# EAGLE design 555 Astable 2 (EAGLE 6.5.0)
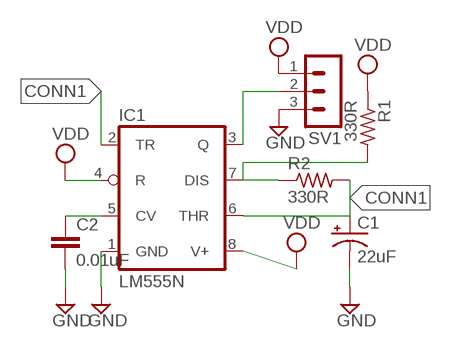
[diagram p0: schematic, sheet 1]

## Parts
C1  22uF  CPOL-USE1.8-4  [E1,8-4]
C2  0.01uF  C-EU050-024X044  [C050-024X044]
IC1  LM555N  [DIL08]
R1  330R  R-US_0207/10  [0207/10]
R2  330R  R-US_0207/10  [0207/10]
SV1  MA03-1  [MA03-1]

## Nets
CONN1: C1.+ IC1.2(TR) IC1.6(THR) R2.2
GND: C1.- C2.2 IC1.1(GND) SV1.3
N$1: C2.1 IC1.5(CV)
N$2: IC1.7(DIS) R1.2 R2.1
N$4: IC1.3(Q) SV1.2
VDD: IC1.4(R) IC1.8(V+) R1.1 SV1.1

## Library data of the parts
C1 = resistor:CPOL-US: POLARIZED CAPACITOR, American symbol
C2 = resistor:C-EU: CAPACITOR, European symbol
IC1 = linear:*555: TIMER
R1 R2 = resistor:R-US_: RESISTOR, American symbol
SV1 = con-lstb:MA03-1: PIN HEADER; OC_FARNELL: unknown; OC_NEWARK: unknown

## Board
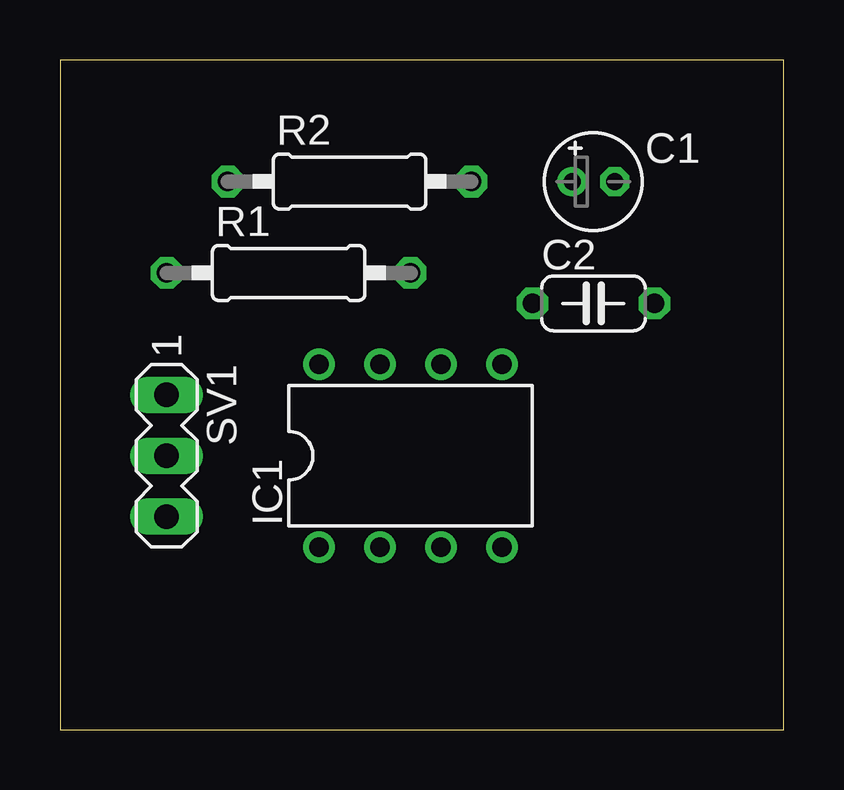
[diagram p1: board, top side]
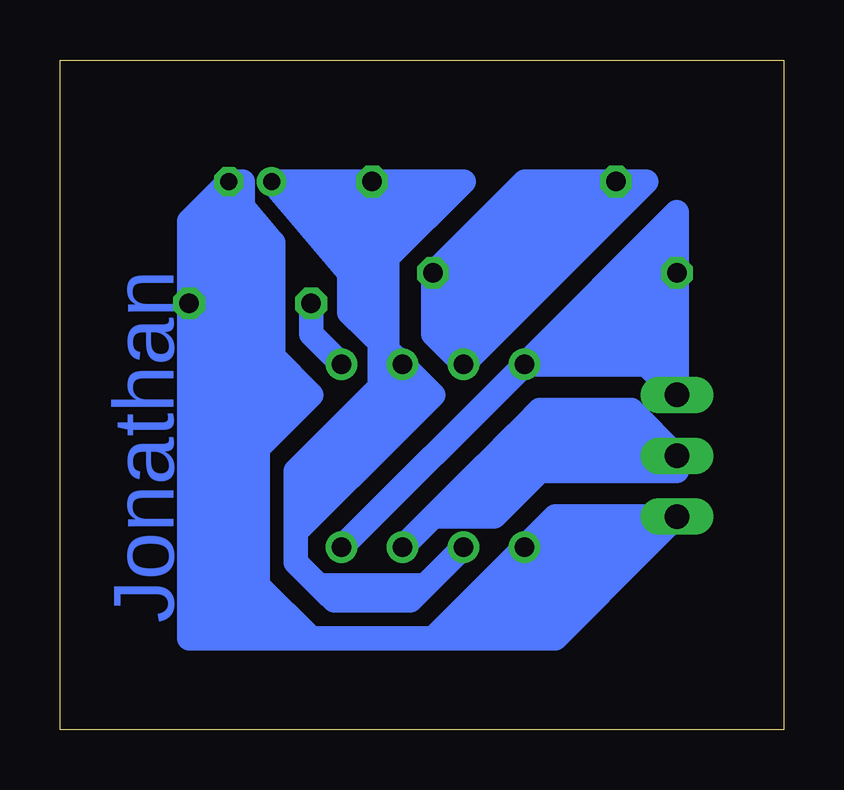
[diagram p2: board, bottom side, seen from below]

Size 30.15 x 27.93 mm. Coordinates in mm from the lower left corner, seen from the top.
Outline: 0,0 30.15,0 30.15,27.93 0,27.93 0,0
Copper layers (1*16): Top 0.035mm / dielectric 1.5mm / Bottom 0.035mm
Design rules "default": minimum track width 10mil, minimum drill 24mil, track to track 8mil, track to pad 8mil, pad to pad 8mil, via to via 8mil, smd to smd 8mil, copper to edge 40mil, drill to drill 8mil, minimum pad ring 10mil, minimum via ring 8mil, stop-mask expansion 4mil, vias tented up to drill 0mil, thermal gap 10mil

### Footprints (pad centres in the part's own frame; a part is rotated, then mirrored left to right if it is on the bottom)
E1,8-4 = drill 0.711 pad 1.168: + -0.889,0 | drill 0.711 pad 1.168 octagon: - 0.889,0
C050-024X044 = drill 0.813 octagon: 1 -2.54,0; 2 2.54,0
DIL08 = drill 0.813 pad 1.27: 1 -3.81,-3.81; 2 -1.27,-3.81; 3 1.27,-3.81; 4 3.81,-3.81; 5 3.81,3.81; 6 1.27,3.81; 7 -1.27,3.81; 8 -3.81,3.81
0207/10 = drill 0.813 octagon: 1 -5.08,0; 2 5.08,0
MA03-1 = drill 1.016 long: 1 -2.54,0; 2 0,0; 3 2.54,0

### Placement (x,y rotation side)
C1  22.23,22.86 0 top
C2  22.23,17.78 0 top
IC1  14.61,11.43 0 top
R1  9.53,19.05 0 top
R2  12.06,22.86 0 top
SV1  4.45,11.43 270 top

### Tracks (layer width: path | path; a pad name or v marks a point on that pad's centre or on a via)
CONN1
  Bottom 1.016: IC1.6 18.1,17.4 18.1,19.05 C1.+ R2.2 16.83,22.86 | IC1.6 15.88,13.97 | 15.88,13.97 15.88,12.7 | 19.37,6.03 19.05,5.71 | 15.88,12.7 14.61,13.97 IC1.6 | IC1.6 15.24,13.97 | 14.92,6.03 19.37,6.03 | 19.05,5.71 18.73,5.4 15.56,5.4 15.24,5.71 | IC1.2 15.24,5.71 | 15.24,5.71 19.05,5.71 | 19.37,6.03 20.32,6.99 20.32,8.26 | 20.32,8.26 15.88,12.7 | 16.83,14.29 20.32,10.79 20.32,9.53 | 20.32,8.26 20.32,9.53 | 20.32,9.53 15.88,13.97 | 14.29,22.86 13.34,22.86 16.51,19.68 16.51,13.97 17.14,13.34 | IC1.6 16.83,14.29 | 16.83,14.29 16.83,22.86 | 16.83,22.86 14.29,22.86 | 14.29,22.86 17.78,19.37 | 17.78,19.37 17.78,17.46 | 17.78,19.37 17.78,20 | 17.78,20 17.78,22.54 20.32,22.54 17.78,20 | 17.78,20 18.73,22.23 15.56,22.23 16.51,21.59
GND
  Bottom 1.016: C1.- 24.77,21.21 C2.2 | 5.71,7.62 IC1.1 | 5.71,7.62 SV1.3 5.08,8.89 | 5.71,7.62 9.53,3.81 10.16,3.81 | 11.43,3.81 12.7,3.81 | 14.61,3.81 19.68,3.81 | 19.68,3.81 21.91,6.03 | 21.91,6.03 22.86,6.99 | 24.13,8.26 24.77,8.89 24.77,9.53 | 5.08,8.89 6.35,8.89 | 7.62,8.89 8.26,8.89 | 8.26,8.89 9.53,8.89 14.61,3.81 | 14.61,3.81 13.34,3.81 | 13.34,3.81 12.7,3.81 | 12.7,3.81 7.62,8.89 | 6.35,8.89 11.43,3.81 | 11.43,3.81 10.16,3.81 | 10.16,3.81 5.08,8.89 | 6.35,8.89 7.62,8.89 | 8.26,8.89 13.34,3.81 | C2.2 24.13,17.78 | 23.5,17.78 22.86,17.78 | 22.86,17.78 22.86,22.23 | 22.86,22.23 22.86,22.86 24.13,21.59 24.13,18.41 23.5,18.41 23.5,21.59 22.86,17.78 | 22.86,17.78 22.86,6.99 | 22.86,6.99 23.18,7.3 | 23.18,7.3 23.5,7.62 | 24.13,8.26 24.13,17.78 | 24.13,17.78 23.5,17.78 | 23.5,17.78 23.5,7.62 | C2.2 22.54,17.78 22.54,22.54 | 22.54,22.54 23.18,22.86 22.54,22.86 22.54,22.54 | C2.2 21.91,17.78 | 21.27,20.32 22.86,22.23 | 22.86,22.23 21.91,20.95 21.91,17.78 | 21.91,6.03 21.91,17.78 | 21.91,17.78 21.27,17.78 | 21.27,17.78 21.27,15.56 | 21.27,13.65 21.27,12.38 | 21.27,12.38 22.23,11.43 | 24.77,9.53 21.27,12.38 | 21.27,12.38 19.68,13.97 21.27,15.56 | 21.27,15.56 21.27,13.65 | 21.27,13.65 20.64,13.97 21.27,15.56 | 21.27,17.78 21.27,20.32 | 21.27,20.32 21.59,19.05 | C2.2 24.77,9.53 | C2.2 24.77,3.81 24.13,3.81 | 19.68,3.81 24.13,3.81 | 24.13,3.81 24.13,8.26 | 24.13,8.26 23.5,7.62 | 23.18,7.3 23.18,4.13 22.23,4.13 22.23,6.03 21.27,4.13
N$1
  Bottom 1.016: C2.1 19.68,16.51 IC1.5
N$2
  Bottom 1.016: 12.7,15.88 IC1.7 14.61,16.51 R1.2 | 12.7,15.88 6.99,21.59 | 6.99,21.59 R2.1 | R1.2 14.61,17.78 13.97,17.14 | 13.34,16.51 12.7,15.88 | 6.99,21.59 5.71,22.86 R2.1 | R1.2 10.79,22.86 R2.1 | R2.1 13.34,16.51 | 13.34,16.51 13.97,17.14 | 13.97,17.14 13.97,19.05 10.79,22.23 10.16,22.23 | 9.53,22.23 8.26,22.23 13.34,17.14 13.34,18.41 | 13.34,18.41 13.34,19.05 10.16,22.23 | 10.16,22.23 9.53,22.23 | 9.53,22.23 13.34,18.41
N$4
  Bottom 1.016: SV1.2 12.06,11.43 | 12.06,11.43 12.7,10.79 | 12.7,10.79 14.61,8.89 | IC1.3 14.61,8.89 | 14.61,8.89 12.06,8.89 10.16,10.79 | 10.16,10.79 10.79,10.79 | 10.79,10.79 12.06,10.79 | 12.06,10.79 13.34,9.53 12.06,9.53 10.79,10.79 | 10.16,10.79 4.45,10.79 SV1.2 | SV1.2 11.43,12.06 | 11.43,12.06 10.79,12.7 | 10.79,12.7 10.16,13.34 6.35,13.34 SV1.2 | 12.06,10.79 12.7,10.79 | 12.06,11.43 11.43,12.06 | 10.79,12.7 6.35,12.7 | SV1.2 7.3,12.38
VDD
  Bottom 1.016: 5.71,15.24 SV1.1 4.45,15.24 | 5.71,15.24 9.53,15.24 | 9.53,15.24 IC1.8 | IC1.4 IC1.8 | 4.45,18.41 R1.1 4.45,19.68 | 4.45,16.51 4.45,15.88 | 4.45,15.88 4.45,15.24 | IC1.8 4.45,21.59 4.45,20.32 | 4.45,15.24 5.71,15.24 | 9.53,15.24 4.45,20.32 | 4.45,20.32 4.45,19.68 | 6.99,15.88 8.26,15.88 4.45,19.68 | 4.45,15.88 6.99,15.88 | 6.99,15.88 4.45,18.41 | 4.45,18.41 4.45,16.51 | 4.45,16.51 5.71,16.51 5.08,17.14

### Text on the board
Bottom: Jonathan